# Altium schematic sheet 07_ADC.SchDoc
size A4
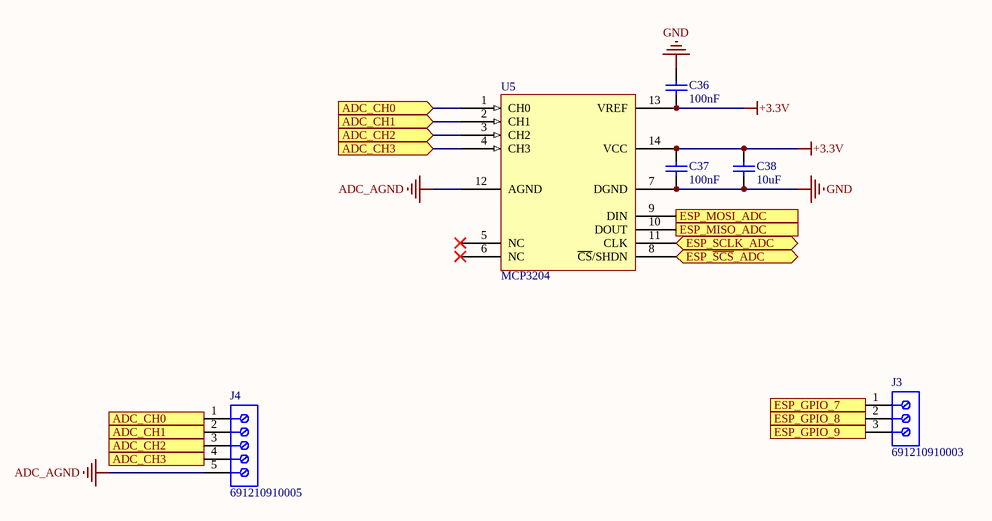
[diagram p0: 07_ADC.SchDoc]

## Parts
C36  value 100nF  [C0402]  (hidden comment: Capacitor)
C37  value 100nF  [C0402]  (hidden comment: Capacitor)
C38  value 10uF  [C0402]  (hidden comment: Capacitor)
J3  691210910003  [691210910003]
J4  691210910005  [691210910005]
U5  MCP3204  [MCP3204-14N]

## Ports
ADC_CH0 (in), ADC_CH0 (out), ADC_CH1 (in), ADC_CH1 (out), ADC_CH2 (in), ADC_CH2 (out), ADC_CH3 (in), ADC_CH3 (out), ESP_GPIO_7 (in), ESP_GPIO_8 (in), ESP_GPIO_9 (in), ESP_MISO_ADC (out), ESP_MOSI_ADC (in), ESP_SCLK_ADC (bidir), ESP_~{SCS}_ADC (bidir)

## Nets
+3.3V: C36.1 C37.2 C38.2 U5.13(VREF) U5.14(VCC)
ADC_AGND: J4.5 U5.12(AGND)
GND: C36.2 C37.1 C38.1 U5.7(DGND)
ADC_CH0: J4.1 U5.1(CH0) ; port ADC_CH0
ADC_CH1: J4.2 U5.2(CH1) ; port ADC_CH1
ADC_CH2: J4.3 U5.3(CH2) ; port ADC_CH2
ADC_CH3: J4.4 U5.4(CH3) ; port ADC_CH3
ESP_GPIO_7: J3.1 ; port ESP_GPIO_7
ESP_GPIO_8: J3.2 ; port ESP_GPIO_8
ESP_GPIO_9: J3.3 ; port ESP_GPIO_9
ESP_MISO_ADC: U5.10(DOUT) ; port ESP_MISO_ADC
ESP_MOSI_ADC: U5.9(DIN) ; port ESP_MOSI_ADC
ESP_~{SCS}_ADC: U5.8(~{CS}/SHDN) ; port ESP_~{SCS}_ADC
ESP_SCLK_ADC: U5.11(CLK) ; port ESP_SCLK_ADC

Not connected (* = marked no-connect by the designer): U5 5(NC)* 6(NC)*

## Library data of the parts
J3 = 691210910003: WR-TBL Serie 2109 Horizontal Entry, Rising Cage Clamp, pitch 2.54mm, 3p; Compliance: Lead free / RoHS; Modularity: No; PCB/Cable/Panel: PCB; Pin Number: 3; Rated Current [UL]: 6A; Working Voltage [UL]: 150VAC; ComponentLink1Description: Manufacturer; ComponentLink1URL: http://www.we-online.de; ComponentLink2URL: https://katalog.we-online.de/em/datasheet/691210910003.pdf; ComponentLink2Description: Datasheet; Mounting Technology: THT; Part Number: 691210910003; Packaging: Box; Operating Temperature: -40 to +105degC; Pitch: 2.54mm; Published Date: October 2019; Type: Horizontal; Publisher: Wurth Elektronik; Application: Rising Cage Clamp
J4 = 691210910005: WR-TBL Serie 2109 Horizontal Entry, Rising Cage Clamp, pitch 2.54mm, 5p; Compliance: Lead free / RoHS; Modularity: No; PCB/Cable/Panel: PCB; Pin Number: 5; Rated Current [UL]: 6A; Working Voltage [UL]: 150VAC; ComponentLink1Description: Manufacturer; ComponentLink1URL: http://www.we-online.de; ComponentLink2URL: https://katalog.we-online.de/em/datasheet/691210910005.pdf; ComponentLink2Description: Datasheet; Mounting Technology: THT; Part Number: 691210910005; Packaging: Box; Operating Temperature: -40 to +105degC; Pitch: 2.54mm; Published Date: October 2019; Type: Horizontal; Publisher: Wurth Elektronik; Application: Rising Cage Clamp